# EAGLE design TSOC_ESP32S (EAGLE 6.6.0)
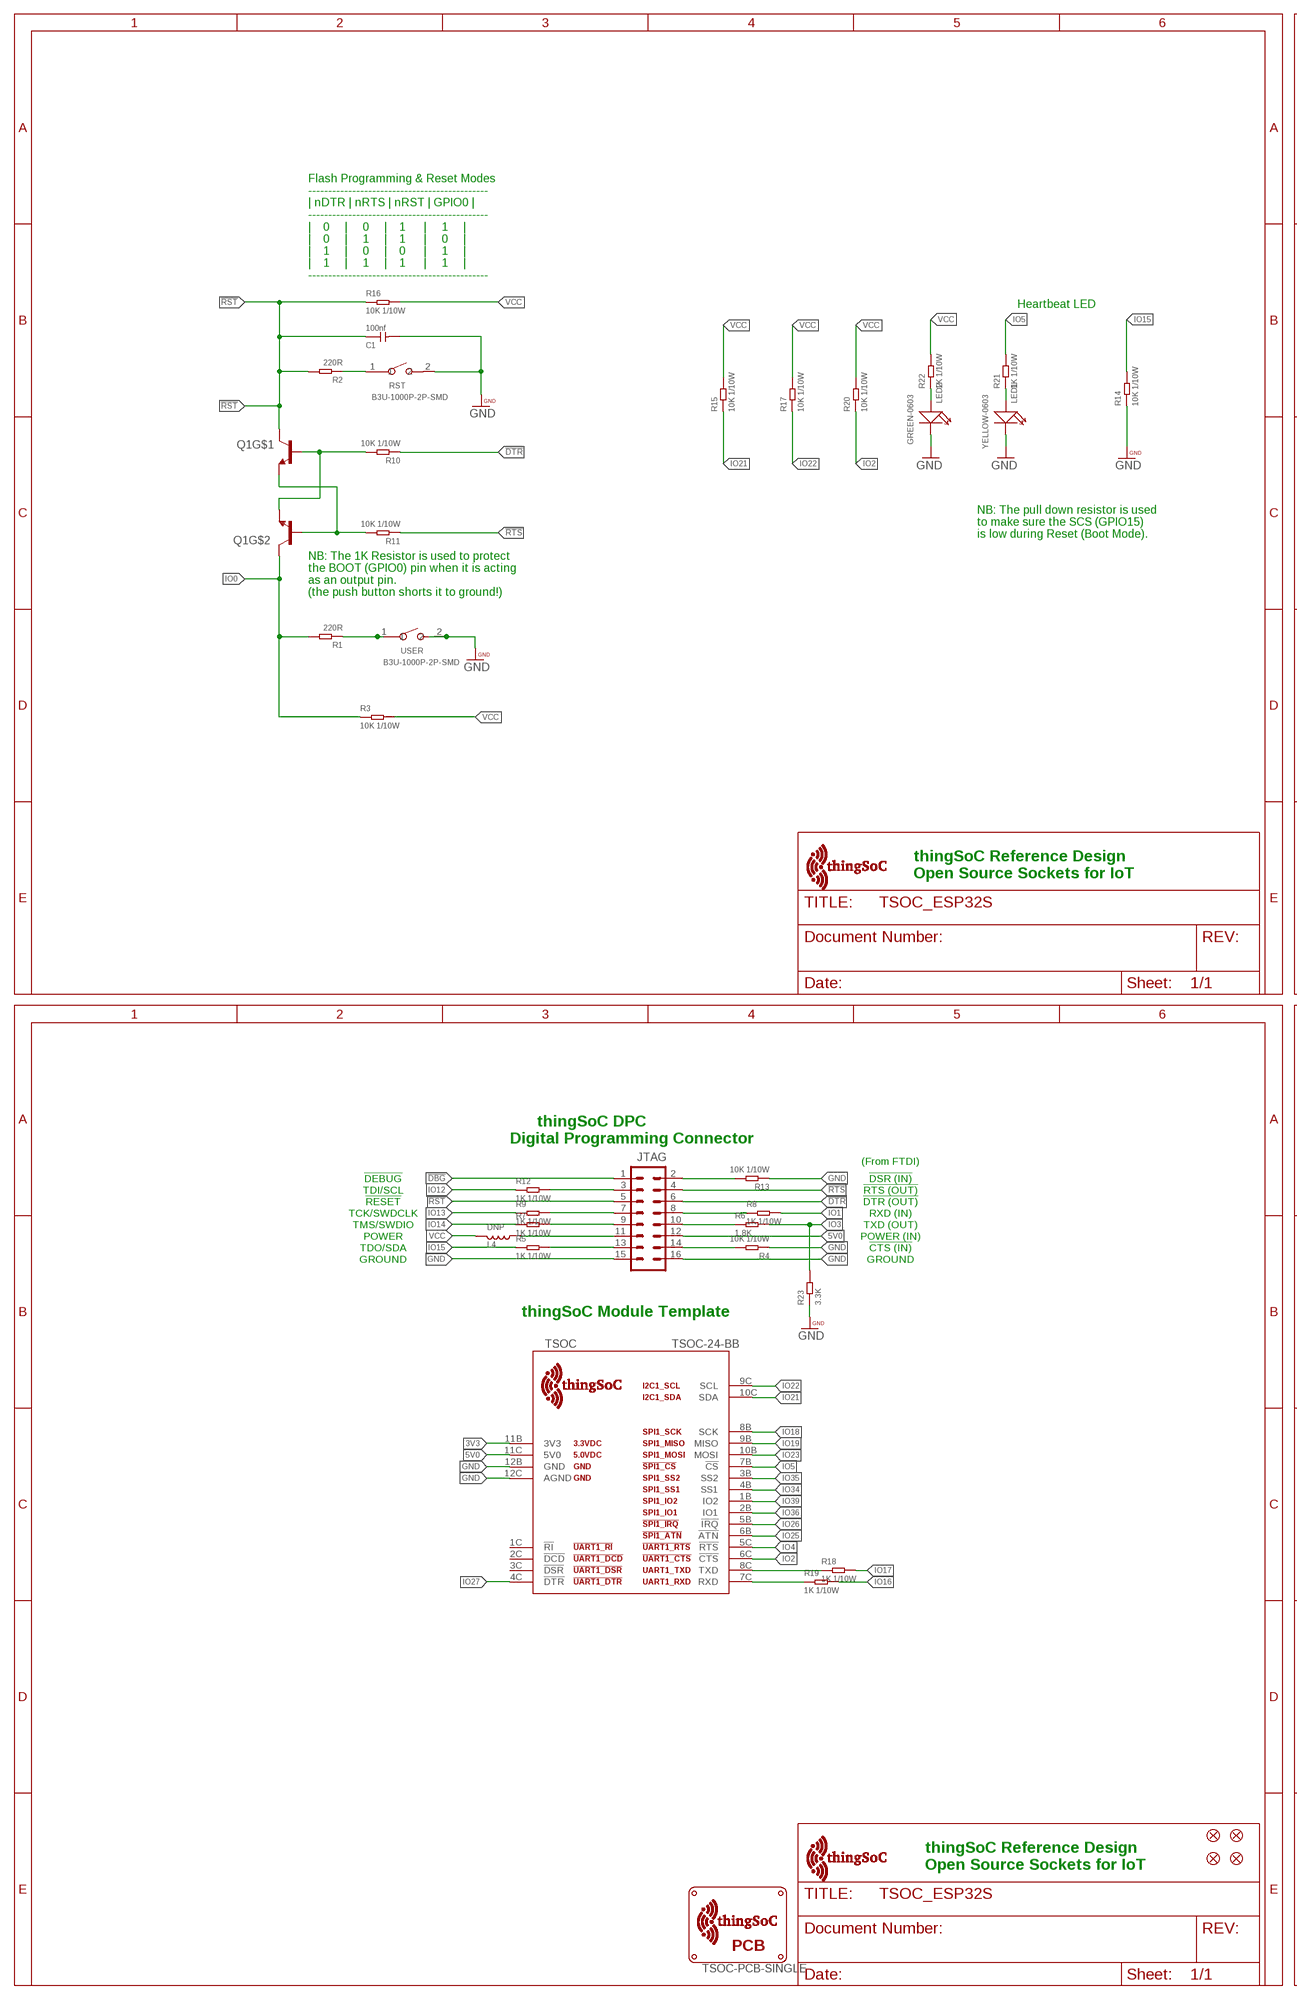
[diagram p0: schematic, sheet 1, part 1 of 2]
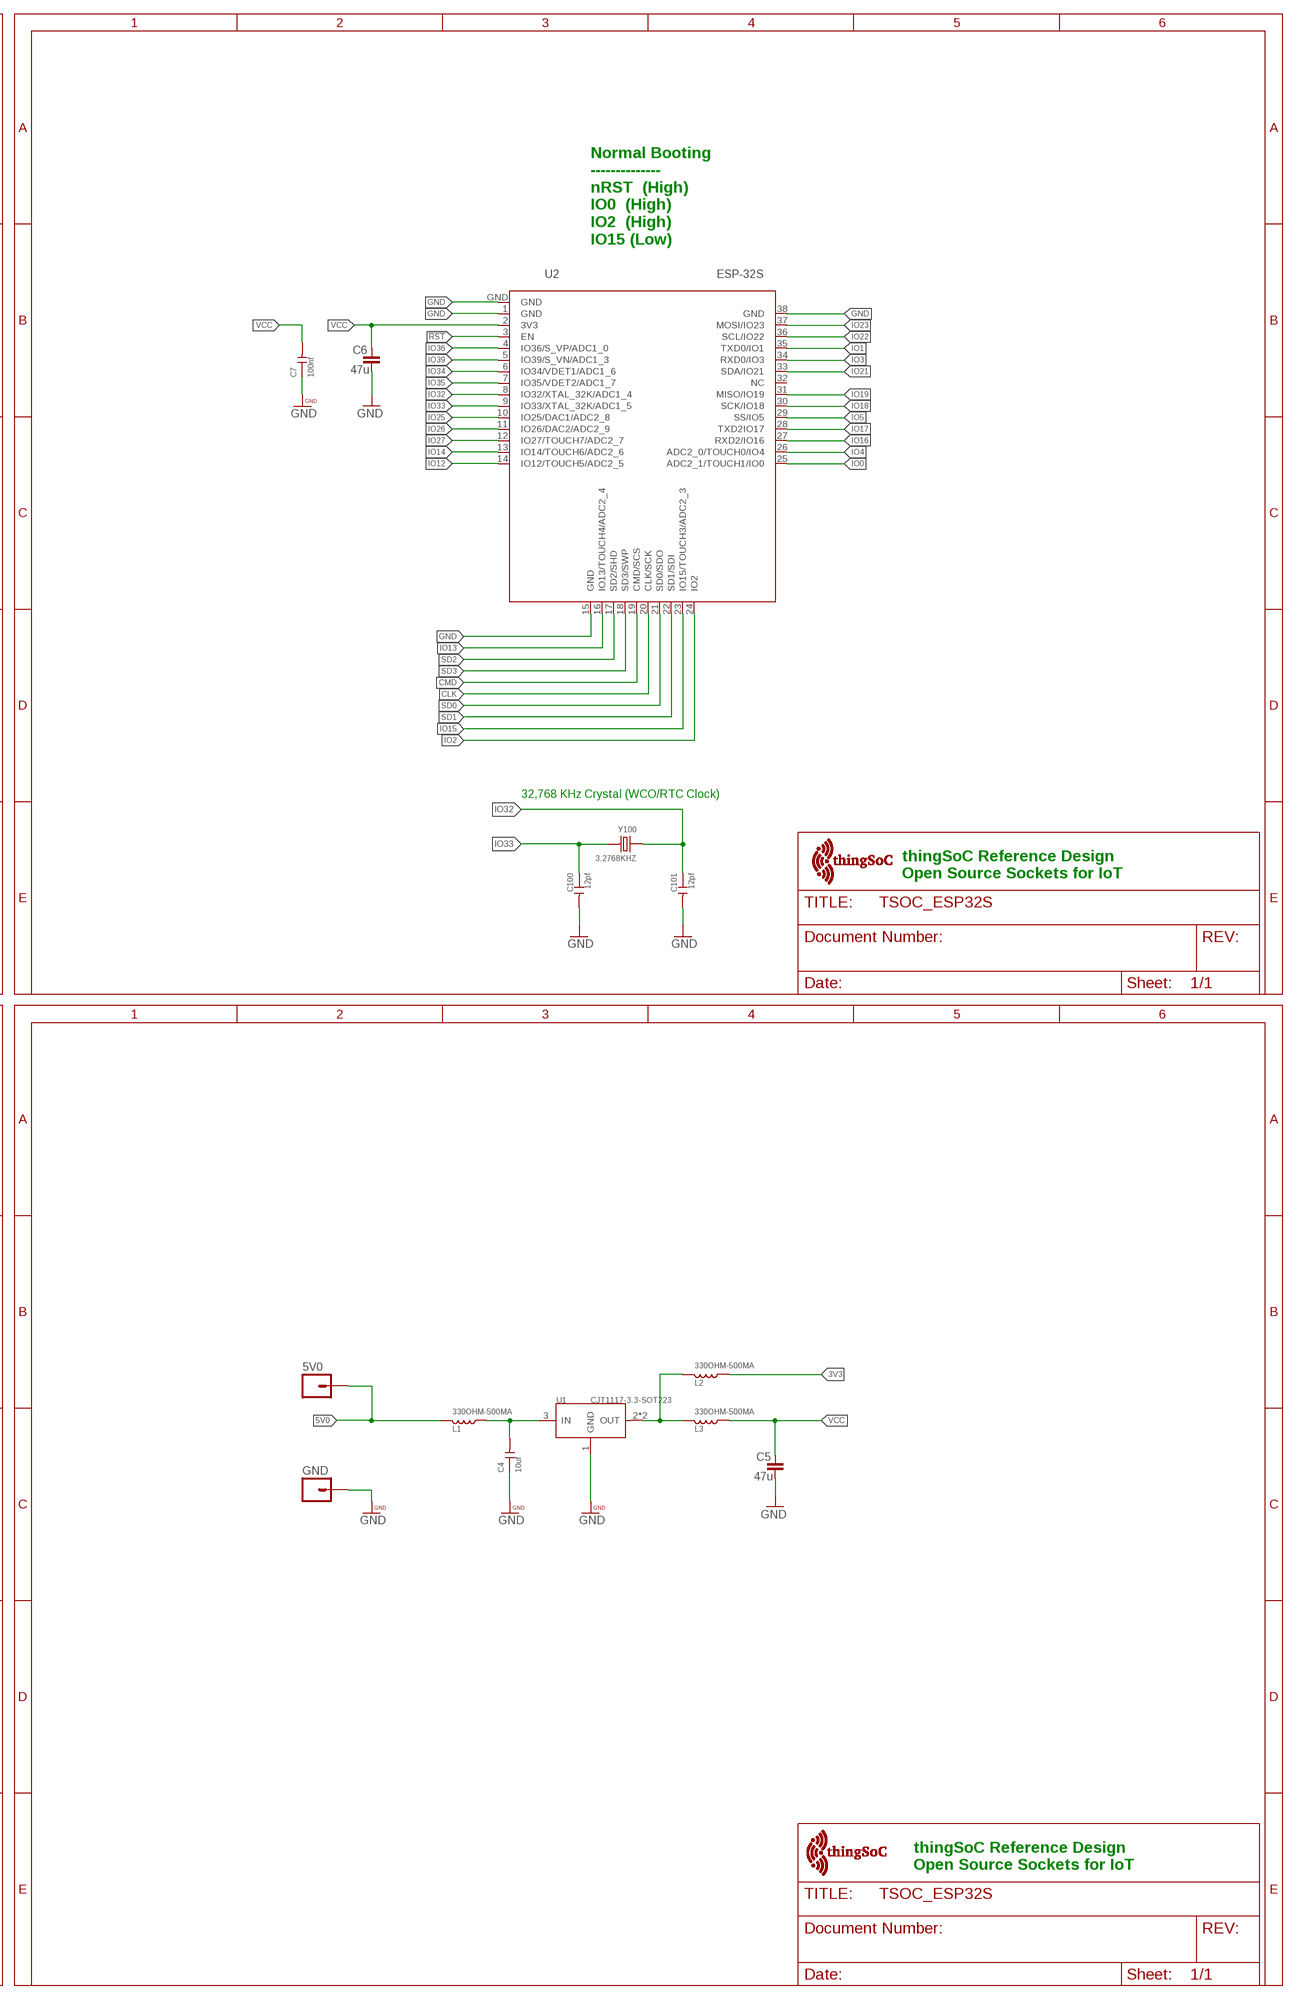
[diagram p1: schematic, sheet 1, part 2 of 2]

## Parts
5V0  M01PTH  [1X01]
$$U$1  TSOC-LOGO-SMALL  [TSOC-LOGO-SML]
$$U$2  TSOC-LOGO-SMALL  [TSOC-LOGO-SML]
BRD  TSOC-PCB-SINGLE  [TSOC-BB-BRD-DIM]
C1  100nf  CERAMIC-100NF-50V-10%-X7R(0603)  [C0603]
C4  10uf  CERAMIC-10UF-10V-10%-X5R(0603)  [C0603]
C5  47u  CAPACITOR-1206  [C1206]
C6  47u  CAPACITOR-1206  [C1206]
C7  100nf  CERAMIC-10UF-10V-10%-X5R(0603)  [C0603]
C100  12pf  CERAMIC-12PF-50V-5%-NPO(0603)  [C0603]
C101  12pf  CERAMIC-12PF-50V-5%-NPO(0603)  [C0603]
FID1  FIDUCIALUFIDUCIAL  [MICRO-FIDUCIAL]
FID2  FIDUCIALUFIDUCIAL  [MICRO-FIDUCIAL]
FID3  FIDUCIALUFIDUCIAL  [MICRO-FIDUCIAL]
FID4  FIDUCIALUFIDUCIAL  [MICRO-FIDUCIAL]
GND  M01PTH  [1X01]
JTAG  M08X2  [2X8]
L1  330OHM-500MA  SMD-FERRITE-CHIP-120-OHM-500MA(0603)  [L0603]
L2  330OHM-500MA  SMD-FERRITE-CHIP-120-OHM-500MA(0603)  [L0603]
L3  330OHM-500MA  SMD-FERRITE-CHIP-120-OHM-500MA(0603)  [L0603]
L4  DNP  SMD-FERRITE-CHIP-120-OHM-500MA(0603)  [L0603]
LED1  YELLOW-0603  SMD-LED-CLEAR-YELLOW(0603)  [LED-0603]
LED2  GREEN-0603  SMD-LED-CLEAR-GREEN(0603)  [LED-0603]
Q1  MMBT2222A  MMDT3904  [SOT363]
R1  220R  SMD-RES-220R-5%-1/10W(0603)  [R0603]
R2  220R  SMD-RES-220R-5%-1/10W(0603)  [R0603]
R3  10K 1/10W  SMD-RES-10K-5%-1/10W(0603)  [R0603]
R4  10K 1/10W  SMD-RES-10K-5%-1/10W(0603)  [R0603]
R5  1K 1/10W  SMD-RES-1K-5%-1/10W(0603)  [R0603]
R6  1.8K  SMD-RES-1.8K-1%-1/10W(0603)  [R0603]
R7  1K 1/10W  SMD-RES-1K-5%-1/10W(0603)  [R0603]
R8  1K 1/10W  SMD-RES-1K-5%-1/10W(0603)  [R0603]
R9  1K 1/10W  SMD-RES-1K-5%-1/10W(0603)  [R0603]
R10  10K 1/10W  SMD-RES-10K-5%-1/10W(0603)  [R0603]
R11  10K 1/10W  SMD-RES-10K-5%-1/10W(0603)  [R0603]
R12  1K 1/10W  SMD-RES-1K-5%-1/10W(0603)  [R0603]
R13  10K 1/10W  SMD-RES-10K-5%-1/10W(0603)  [R0603]
R14  10K 1/10W  SMD-RES-10K-5%-1/10W(0603)  [R0603]
R15  10K 1/10W  SMD-RES-10K-5%-1/10W(0603)  [R0603]
R16  10K 1/10W  SMD-RES-10K-5%-1/10W(0603)  [R0603]
R17  10K 1/10W  SMD-RES-10K-5%-1/10W(0603)  [R0603]
R18  1K 1/10W  SMD-RES-1K-5%-1/10W(0603)  [R0603]
R19  1K 1/10W  SMD-RES-1K-5%-1/10W(0603)  [R0603]
R20  10K 1/10W  SMD-RES-10K-5%-1/10W(0603)  [R0603]
R21  1K 1/10W  SMD-RES-1K-5%-1/10W(0603)  [R0603]
R22  1K 1/10W  SMD-RES-1K-5%-1/10W(0603)  [R0603]
R23  3.3K  SMD-RES-3.3K-1%-1/10W(0603)  [R0603]
RST  B3U-1000P-2P-SMD  SMD-BUTTON(2P-3.0X2.5X1.2+0.4MM)-B3U-1000P-2P-SMD  [SW2-2.6-3.0X2.5X1.2+0.4MM]
TSOC  TSOC-24-BB  [TSOC-BB-S24]
U1  CJT1117-3.3-SOT223  PMIC-CJT1117-3.3(SOT223)  [SOT-223]
U2  ESP-32S  [ESP-32S]
U$101  TSOC-LOGO-SMALL  [TSOC-LOGO-SML]
U$102  TSOC-LOGO-LRG  [TSOC-LOGO-LRG]
USER  B3U-1000P-2P-SMD  SMD-BUTTON(2P-3.0X2.5X1.2+0.4MM)-B3U-1000P-2P-SMD  [SW2-2.6-3.0X2.5X1.2+0.4MM]
Y100  3.2768KHZ  SMD-CRYSTAL-32.768KHZ-12.5PF-20PPM-90K(2P-L2.0X1.2MM)  [X2-SMD-L2.0X1.2X0.55MM]

## Nets
3V3: L2.2 TSOC.11B(3V3)
5V: C4.2 L1.2 U1.3(IN)
5V0: 5V0.1 JTAG.12 L1.1 TSOC.11C(5V0)
!CTS: JTAG.14 R4.2
!DBG: JTAG.1
!DSRE: JTAG.2 R13.2
!DTR: JTAG.6 R10.1
!RST: C1.1 JTAG.5 Q1.3(C) R2.2 R16.1 U2.3(EN)
!RTS: JTAG.4 R11.1
CLK: U2.20(CLK/SCK)
CMD: U2.19(CMD/SCS)
GND: C1.2 C4.1 C5.1 C6.1 C7.1 C100.2 C101.2 GND.1 JTAG.15 JTAG.16 LED1.- LED2.- R4.1 R13.1 R14.1 R23.1 RST.2 TSOC.12B(GND) TSOC.12C(AGND) U1.1(GND) U2.1(GND) U2.15(GND) U2.38(GND) U2.GND USER.2
IO0: Q1.6(C) R1.2 R3.1 U2.25(ADC2_1/TOUCH1/IO0)
IO1: R8.2 U2.35(TXD0/IO1)
IO2: R20.1 TSOC.6C(!CTS) U2.24(IO2)
IO3: R6.2 R23.2 U2.34(RXD0/IO3)
IO4: TSOC.5C(!RTS) U2.26(ADC2_0/TOUCH0/IO4)
IO5: R21.2 TSOC.7B(!CS) U2.29(SS/IO5)
IO12: R12.1 U2.14(IO12/TOUCH5/ADC2_5)
IO12E: JTAG.3 R12.2
IO13: R9.1 U2.16(IO13/TOUCH4/ADC2_4)
IO13E: JTAG.7 R9.2
IO14: R7.1 U2.13(IO14/TOUCH6/ADC2_6)
IO14E: JTAG.9 R7.2
IO15: R5.1 R14.2 U2.23(IO15/TOUCH3/ADC2_3)
IO15E: JTAG.13 R5.2
IO16: R19.2 U2.27(RXD2/IO16)
IO16E: R19.1 TSOC.7C(RXD)
IO17: R18.2 U2.28(TXD2IO17)
IO17E: R18.1 TSOC.8C(TXD)
IO18: TSOC.8B(SCK) U2.30(SCK/IO18)
IO19: TSOC.9B(MISO) U2.31(MISO/IO19)
IO21: R15.1 TSOC.10C(SDA) U2.33(SDA/IO21)
IO22: R17.1 TSOC.9C(SCL) U2.36(SCL/IO22)
IO23: TSOC.10B(MOSI) U2.37(MOSI/IO23)
IO25: TSOC.6B(!ATN) U2.10(IO25/DAC1/ADC2_8)
IO26: TSOC.5B(!IRQ) U2.11(IO26/DAC2/ADC2_9)
IO27: TSOC.4C(!DTR) U2.12(IO27/TOUCH7/ADC2_7)
IO32: C101.1 U2.8(IO32/XTAL_32K/ADC1_4) Y100.1
IO33: C100.1 U2.9(IO33/XTAL_32K/ADC1_5) Y100.2
IO34: TSOC.4B(SS1) U2.6(IO34/VDET1/ADC1_6)
IO35: TSOC.3B(SS2) U2.7(IO35/VDET2/ADC1_7)
IO36: TSOC.2B(IO1) U2.4(IO36/S_VP/ADC1_0)
IO39: TSOC.1B(IO2) U2.5(IO39/S_VN/ADC1_3)
N$1: LED1.+ R21.1
N$2: R1.1 USER.1
N$3: R2.1 RST.1
N$4: JTAG.11 L4.2
N$17: LED2.+ R22.1
RES: Q1.1(E) Q1.5(B) R10.2
ROS: Q1.2(B) Q1.4(E) R11.2
RXI: JTAG.8 R8.1
SD0: U2.21(SD0/SDO)
SD1: U2.22(SD1/SDI)
SD2: U2.17(SD2/SHD)
SD3: U2.18(SD3/SWP)
TXD: JTAG.10 R6.1
VCC: C5.2 C6.2 C7.2 L3.2 L4.1 R3.2 R15.2 R16.2 R17.2 R20.2 R22.2 U2.2(3V3)
VOUT: L2.1 L3.1 U1.2(OUT) U1.TER(OUT)
Unconnected: TSOC.1C(!RI) TSOC.2C(!DCD) TSOC.3C(!DSR) U2.32(NC)

## Notes on the sheet
- Normal Booting
  --------------
  nRST  (High)
  IO0  (High)
  IO2  (High) 
  IO15 (Low)
- Flash Programming & Reset Modes
  ---------------------------------------------
  | nDTR | nRTS | nRST | GPIO0 |
  ---------------------------------------------
  |    0     |     0     |    1      |     1     |
  |    0     |     1     |    1      |     0     |
  |    1     |     0     |    0      |     1     |
  |    1     |     1     |    1      |     1     |
  ---------------------------------------------
- Heartbeat LED
- NB: The pull down resistor is used 
  to make sure the SCS (GPIO15)
  is low during Reset (Boot Mode).
- NB: The 1K Resistor is used to protect
  the BOOT (GPIO0) pin when it is acting
  as an output pin.
  (the push button shorts it to ground!)
- 32,768 KHz Crystal (WCO/RTC Clock)
- thingSoC Reference Design
  Open Source Sockets for IoT
- thingSoC Reference Design
  Open Source Sockets for IoT
- thingSoC DPC
  Digital Programming Connector
- (From FTDI)
- !DEBUG | !DSR (IN)
- TDI/SCL | !RTS (OUT)
- !RESET | !DTR (OUT)
- TCK/SWDCLK | RXD (IN)
- TMS/SWDIO | TXD (OUT)
- POWER | POWER (IN)
- TDO/SDA | !CTS (IN)
- GROUND | GROUND
- thingSoC Module Template
- thingSoC Reference Design
  Open Source Sockets for IoT
- thingSoC Reference Design
  Open Source Sockets for IoT

## Library data of the parts
5V0 GND = PatternAgents-ProtoPads:M01: Header 1 Standard 1-pin 0.1" header. Use with straight break away headers (SKU : PRT-00116), right angle break away headers (PRT-00553), swiss pins (PRT-00743), machine pins (PRT-00117), and female headers (PRT-00115). SMTSO-256-ET is a "flush mount" nut for a 4-40 screw. The older package used to be too tight, and did not allow it to sit properly thru the drill hit. The latest (0.165DIA) fits nice and snug.
$$U$1 $$U$2 U$101 U$102 = thingSoC:TSOC-LOGO: thingSoC Logo Source LBR : http://www.thingsoc.com Github : https://github.com/thingsoc License : http://creativecommons.org/licenses/by-sa/4.0/ (Creative Commons 4.0) THIS SOFTWARE IS PROVIDED BY THE CONTRIBUTORS "AS IS" AND WITHOUT ANY EXPRESS OR IMPLIED WARRANTIES, INCLUDING, BUT NOT LIMITED TO, THE IMPLIED WARRANTIES OF MERCHANTABILITY AND FITNESS FOR A PARTICULAR PURPOSE ARE DISCLAIMED. IN NO EVENT SHALL THE COPYRIGHT OWNER OR CONTRIBUTORS BE LIABLE FOR ANY DIRECT, INDIRECT, INCIDENTAL, SPECIAL, EXEMPLARY, OR CONSEQUENTIAL DAMAGES (INCLUDING, BUT NOT LIMITED TO, PROCUREMENT OF SUBSTITUTE GOODS OR SERVICES; LOSS OF USE, DATA, OR PROFITS; OR BUSINESS INTERRUPTION) HOWEVER CAUSED AND ON ANY THEORY OF LIABILITY, WHETHER IN CONTRACT, STRICT LIABILITY, OR TORT (INCLUDING NEGLIGENCE OR OTHERWISE) ARISING IN ANY WAY OUT OF THE USE OF THIS SOFTWARE, EVEN IF ADVISED OF THE POSSIBILITY OF SUCH DAMAGE.
BRD = thingSoC:TSOC-PCB: thingSoC PCB Outlines Boards Outlines for Standard Sizes (in the DImension Layer) (Registration marks in the tDocu layer - make sure to turn on tDocu/bDocu) Source LBR : http://www.thingsoc.com Github : https://github.com/thingsoc License : http://creativecommons.org/licenses/by-sa/4.0/ (Creative Commons 4.0) THIS SOFTWARE IS PROVIDED BY THE CONTRIBUTORS "AS IS" AND WITHOUT ANY EXPRESS OR IMPLIED WARRANTIES, INCLUDING, BUT NOT LIMITED TO, THE IMPLIED WARRANTIES OF MERCHANTABILITY AND FITNESS FOR A PARTICULAR PURPOSE ARE DISCLAIMED. IN NO EVENT SHALL THE COPYRIGHT OWNER OR CONTRIBUTORS BE LIABLE FOR ANY DIRECT, INDIRECT, INCIDENTAL, SPECIAL, EXEMPLARY, OR CONSEQUENTIAL DAMAGES (INCLUDING, BUT NOT LIMITED TO, PROCUREMENT OF SUBSTITUTE GOODS OR SERVICES; LOSS OF USE, DATA, OR PROFITS; OR BUSINESS INTERRUPTION) HOWEVER CAUSED AND ON ANY THEORY OF LIABILITY, WHETHER IN CONTRACT, STRICT LIABILITY, OR TORT (INCLUDING NEGLIGENCE OR OTHERWISE) ARISING IN ANY WAY OUT OF THE USE OF THIS SOFTWARE, EVEN IF ADVISED OF THE POSSIBILITY OF SUCH DAMAGE.
C1 = Seeed-Capacitor-2016:CERAMIC-100NF-50V-10%-X7R(0603): 302010138; MPN: CC0603KRX7R9BB104
C4 = Seeed-Capacitor-2016:CERAMIC-10UF-10V-10%-X5R(0603): 302010103; MPN: CC0603KRX5R6BB106
C5 C6 = we-rcl:CAPACITOR: Capacitors ...2.2uF @ 6.3V -> 0402 ...4.7uF @ 6.3V -> 0603 ...10uF @ 16V -> 0805 ...22uF @ 25V -> 1206
C7 = Seeed-Capacitor-2016:CERAMIC-10UF-10V-10%-X5R(0603): 302010103; MPN: CC0603KRX5R6BB106; VALUE: 10uf
C100 C101 = Seeed-Capacitor-2016:CERAMIC-12PF-50V-5%-NPO(0603): 302010067; MPN: CC0603JRNPO9BN120
FID1-FID4 = TSOC-ESP8266-BASE:FIDUCIAL: Fiducial Alignment Points Various fiducial points for machine vision alignment.
JTAG = PatternAgents-ProtoPads:M08X2: .1" headers, two rows of 8 each
L1-L4 = Seeed-Inductor-2016:SMD-FERRITE-CHIP-120-OHM-500MA(0603): 303030001; MPN: BLM18AG121SN1D; VALUE: 120OHM-500MA
LED1 = Seeed-LED-2016:SMD-LED-CLEAR-YELLOW(0603): 304090044; MPN: 19-217-Y5C-AM1N1VY-3T
LED2 = Seeed-LED-2016:SMD-LED-CLEAR-GREEN(0603): 304090043; MPN: 19-217-G7C-AN1P2-3T
Q1 = SparkFun-DiscreteSemi:MMDT3904: Dual NPN transistor
R1 R2 = Seeed-Resistor-2016:SMD-RES-220R-5%-1/10W(0603): 301010163; MPN: RC0603JR-07220RL
R3 R4 R10 R11 R13-R17 R20 = Seeed-Resistor-2016:SMD-RES-10K-5%-1/10W(0603): 301010293; MPN: RC0603JR-0710KL
R5 R7-R9 R12 R18 R19 R21 R22 = Seeed-Resistor-2016:SMD-RES-1K-5%-1/10W(0603): 301010291; MPN: RC0603JR-071KL
R6 = Seeed-Resistor-2016:SMD-RES-1.8K-1%-1/10W(0603): 301010254; MPN: RC0603FR-071K8L
R23 = Seeed-Resistor-2016:SMD-RES-3.3K-1%-1/10W(0603): 301010251; MPN: RC0603FR-073K3L
RST USER = Seeed-Switch-2016:SMD-BUTTON(2P-3.0X2.5X1.2+0.4MM): 311020047; MPN: B3U-1000P-2P-SMD
TSOC = thingSoC:TSOC-24: thingSoC Twenty-Four(24) Pin Socket Source LBR : http://www.thingsoc.com Github : https://github.com/thingsoc License : http://creativecommons.org/licenses/by-sa/4.0/ (Creative Commons 4.0) THIS SOFTWARE IS PROVIDED BY THE CONTRIBUTORS "AS IS" AND WITHOUT ANY EXPRESS OR IMPLIED WARRANTIES, INCLUDING, BUT NOT LIMITED TO, THE IMPLIED WARRANTIES OF MERCHANTABILITY AND FITNESS FOR A PARTICULAR PURPOSE ARE DISCLAIMED. IN NO EVENT SHALL THE COPYRIGHT OWNER OR CONTRIBUTORS BE LIABLE FOR ANY DIRECT, INDIRECT, INCIDENTAL, SPECIAL, EXEMPLARY, OR CONSEQUENTIAL DAMAGES (INCLUDING, BUT NOT LIMITED TO, PROCUREMENT OF SUBSTITUTE GOODS OR SERVICES; LOSS OF USE, DATA, OR PROFITS; OR BUSINESS INTERRUPTION) HOWEVER CAUSED AND ON ANY THEORY OF LIABILITY, WHETHER IN CONTRACT, STRICT LIABILITY, OR TORT (INCLUDING NEGLIGENCE OR OTHERWISE) ARISING IN ANY WAY OUT OF THE USE OF THIS SOFTWARE, EVEN IF ADVISED OF THE POSSIBILITY OF SUCH DAMAGE.
U1 = Seeed-IC-2016:PMIC-CJT1117-3.3(SOT223): 310030097; MPN: CJT1117-3.3
U2 = PatternAgents_RFmodules:ESP-32S
Y100 = Seeed-Crystal Oscillator-2016:SMD-CRYSTAL-32.768KHZ-12.5PF-20PPM-90K(2P-L2.0X1.2MM): 306010020; MPN: FC-12M

## Net classes
1 vcc: width 0.254 mm

## Board
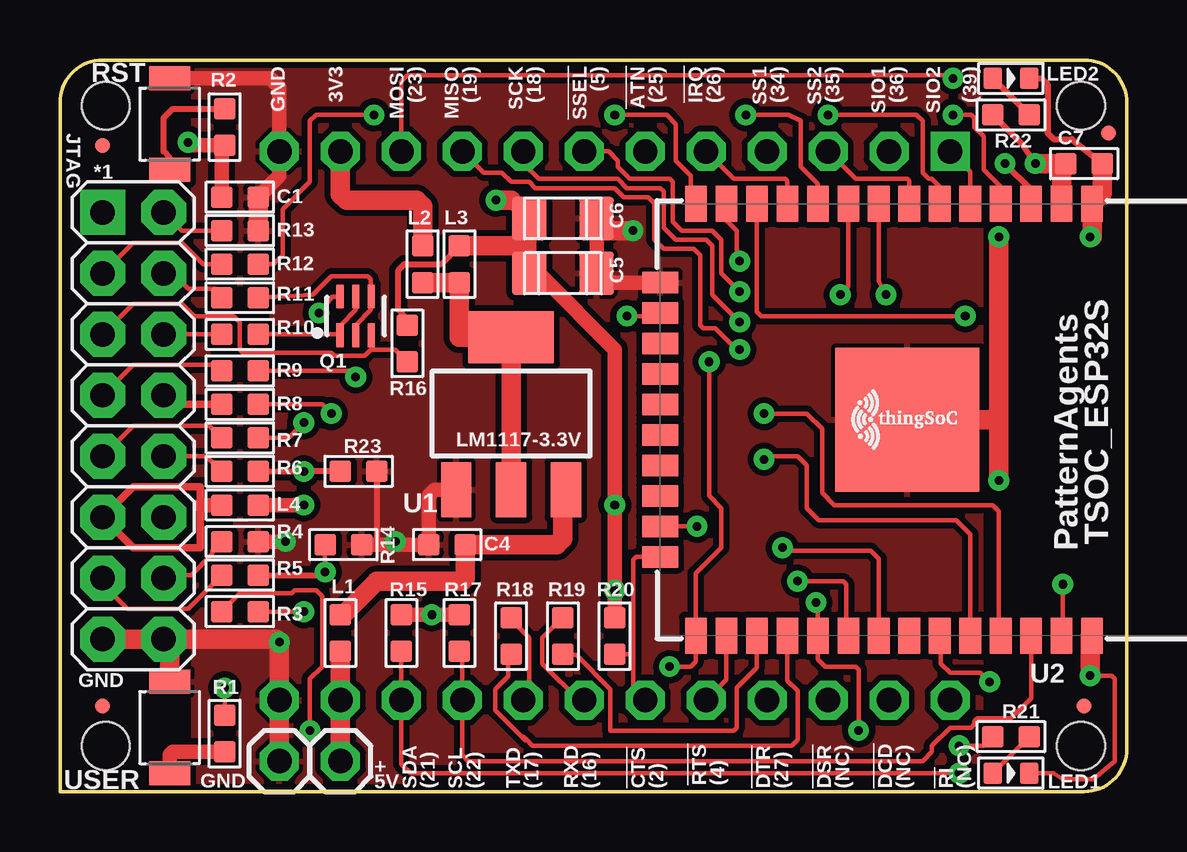
[diagram p2: board, top side]
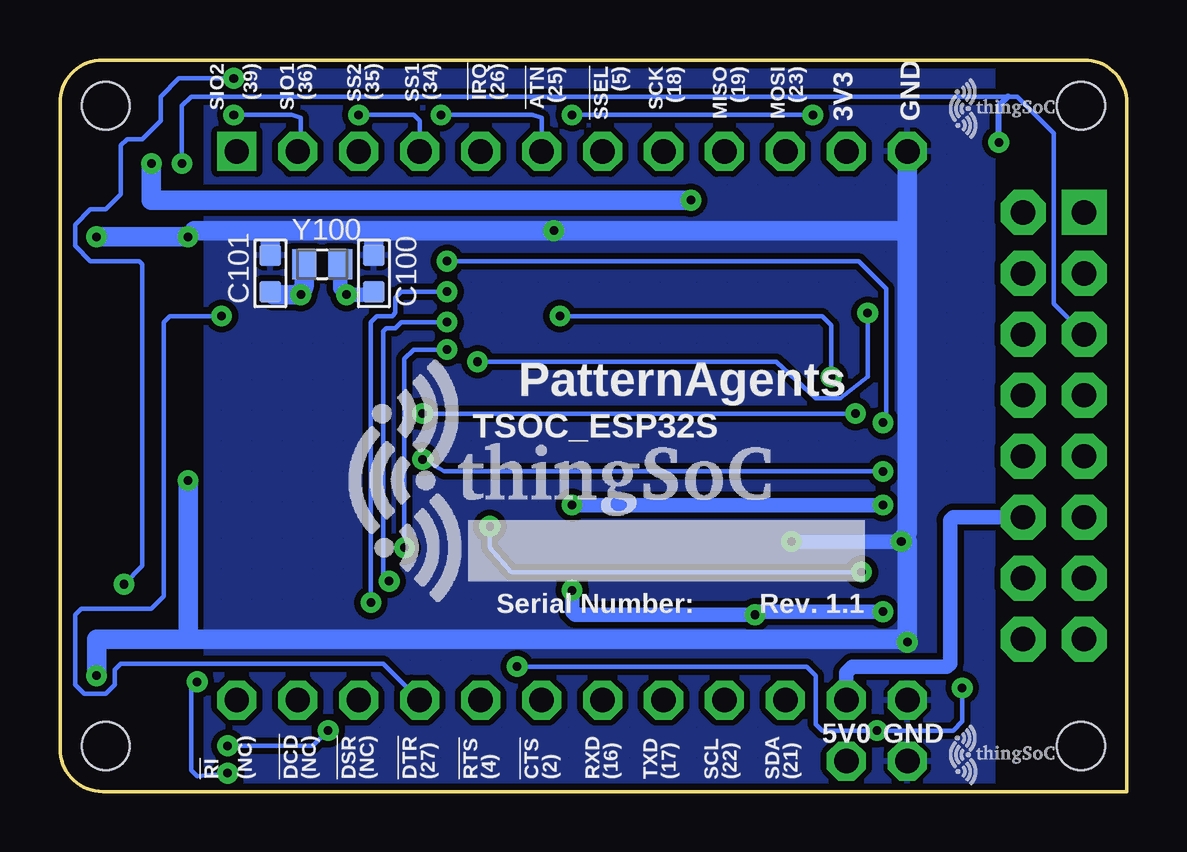
[diagram p3: board, bottom side, seen from below]

Size 44.45 x 30.48 mm. Coordinates in mm from the lower left corner, seen from the top.
Copper layers (1*16): Top 0.035mm / dielectric 1.5mm / Bottom 0.035mm
Design rules "PatternAgents_7mil": minimum track width 7mil, minimum drill 14mil, track to track 7mil, track to pad 7mil, pad to pad 7mil, via to via 7mil, smd to smd 7mil, copper to edge 7mil, drill to drill 7mil, minimum pad ring 12mil, minimum via ring 10mil, stop-mask expansion 4mil, vias tented up to drill 25mil, thermal gap 7mil

### Footprints (pad centres in the part's own frame; a part is rotated, then mirrored left to right if it is on the bottom)
1X01 = drill 1.016 octagon: 1 0,0
TSOC-BB-BRD-DIM = hole 2: 13.335,16.891; -13.335,16.891; 13.335,-23.749; -13.335,-23.749
C0603 = smd 0.889 x 0.889: 1 0,0.762; 2 0,-0.762
C1206 = smd 1.8 x 1.45: 1 0,1.4; 2 0,-1.4
MICRO-FIDUCIAL = smd 0.635 x 0.635: 1 0,0
2X8 = drill 1.016 pad 1.88 square: 1 0,0 | drill 1.016 pad 1.88 octagon: 2 0,2.54; 3 2.54,0; 4 2.54,2.54; 5 5.08,0; 6 5.08,2.54; 7 7.62,0; 8 7.62,2.54; 9 10.16,0; 10 10.16,2.54; 11 12.7,0; 12 12.7,2.54; 13 15.24,0; 14 15.24,2.54; 15 17.78,0; 16 17.78,2.54
L0603 = smd 0.889 x 0.889: 1 -0.762,0; 2 0.762,0
LED-0603 = smd 0.762 x 0.889: + -0.762,0; - 0.762,0
SOT363 = smd 0.3 x 0.99: 1 -0.65,-0.8; 2 0,-0.8; 3 0.65,-0.8; 4 0.65,0.81; 5 0,0.81; 6 -0.65,0.81
R0603 = smd 0.889 x 0.889: 1 0,0.762; 2 0,-0.762
SW2-2.6-3.0X2.5X1.2+0.4MM = smd 1 x 1.7: 1 -1.9,0; 2 1.9,0
TSOC-BB-S24 = drill 1.016 square: 1B -11.43,11.43 | drill 1.016 octagon: 1C 11.43,11.43; 2B -11.43,8.89; 2C 11.43,8.89; 3B -11.43,6.35; 3C 11.43,6.35; 4B -11.43,3.81; 4C 11.43,3.81; 5B -11.43,1.27; 5C 11.43,1.27; 6B -11.43,-1.27; 6C 11.43,-1.27; 7B -11.43,-3.81; 7C 11.43,-3.81; 8B -11.43,-6.35; 8C 11.43,-6.35; 9B -11.43,-8.89; 9C 11.43,-8.89; 10B -11.43,-11.43; 10C 11.43,-11.43; 11B -11.43,-13.97; 11C 11.43,-13.97; 12B -11.43,-16.51; 12C 11.43,-16.51
SOT-223 = smd 1.27 x 2.286: 1 -2.286,-3.175; 2 0,-3.175; 3 2.286,-3.175 | smd 3.556 x 2.159: TER 0,3.175
ESP-32S = smd 0.9 x 1.5: 1 7.7,9; 2 6.43,9; 3 5.16,9; 4 3.89,9; 5 2.62,9; 6 1.35,9; 7 0.08,9; 8 -1.19,9; 9 -2.46,9; 10 -3.73,9; 11 -5,9; 12 -6.27,9; 13 -7.54,9; 14 -8.81,9; 25 -8.81,-9; 26 -7.54,-9; 27 -6.27,-9; 28 -5,-9; 29 -3.73,-9; 30 -2.46,-9; 31 -1.19,-9; 32 0.08,-9; 33 1.35,-9; 34 2.62,-9; 35 3.89,-9; 36 5.16,-9; 37 6.43,-9; 38 7.7,-9 | smd 1.5 x 0.9: 15 -10.3,5.715; 16 -10.3,4.445; 17 -10.3,3.175; 18 -10.3,1.905; 19 -10.3,0.635; 20 -10.3,-0.635; 21 -10.3,-1.905; 22 -10.3,-3.175; 23 -10.3,-4.445; 24 -10.3,-5.715 | smd 6 x 6: GND 0,0
X2-SMD-L2.0X1.2X0.55MM = smd 1 x 1.25: 1 -0.75,0; 2 0.75,0

### Placement (x,y rotation side)
5V0  11.68,1.27 0 top
$$U$1  33.78,15.49 0 top
$$U$2  33.78,15.49 0 top
BRD  25.65,15.24 270 top
C1  7.49,24.77 90 top
C4  16.13,10.29 90 top
C5  20.95,21.59 270 top
C6  20.95,23.88 270 top
C7  42.67,26.16 270 top
C100  31.37,21.59 180 bottom
C101  35.69,21.59 180 bottom
FID1  1.78,3.56 0 top
FID2  1.78,26.92 0 top
FID3  42.67,3.56 0 top
FID4  43.69,27.43 0 top
GND  9.14,1.27 0 top
JTAG  1.78,24.13 270 top
L1  11.68,6.6 90 top
L2  15.11,21.97 90 top
L3  16.64,21.97 90 top
L4  7.49,11.94 180 top
LED1  39.62,0.76 0 top
LED2  39.62,29.72 0 top
Q1  12.32,19.81 0 top
R1  6.86,2.41 180 top
R2  6.86,27.69 0 top
R3  7.49,7.49 90 top
R4  7.49,10.41 270 top
R5  7.49,9.02 270 top
R6  7.49,13.34 90 top
R7  7.49,14.73 270 top
R8  7.49,16.13 90 top
R9  7.49,17.53 270 top
R10  7.49,19.05 90 top
R11  7.49,20.57 90 top
R12  7.49,21.97 270 top
R13  7.49,23.37 270 top
R14  11.81,10.29 270 top
R15  14.22,6.6 180 top
R16  14.48,18.67 180 top
R17  16.64,6.6 180 top
R18  18.8,6.48 0 top
R19  20.95,6.48 0 top
R20  23.11,6.48 180 top
R21  39.62,2.29 270 top
R22  39.62,28.19 270 top
R23  12.45,13.34 270 top
RST  4.57,27.81 90 top
TSOC  25.65,15.24 270 top
U1  18.8,15.75 0 top
U2  35.31,15.49 0 top
U$100  TSOC-LOGO-SMALL  [TSOC-LOGO-SML]  6.6,1.52 0 bottom
U$101  6.6,28.45 0 bottom
U$102  29.21,12.95 0 bottom
USER  4.57,2.67 90 top
Y100  33.53,21.97 0 bottom

### Tracks (layer width: path | path; a pad name or v marks a point on that pad's centre or on a via)
3V3
  Top 0.813: L2.2 15.11,24.38 14.86,24.64 11.94,24.64 11.68,24.89 TSOC.11B
5V
  Top 0.813: L1.2 11.81,7.37 13.21,8.76 16.76,8.76 16.89,8.89 C4.2 20.7,10.29 20.95,10.54 20.95,12.45 U1.3
5V0
  Top 0.813: 5V0.1 TSOC.11C L1.1
  Bottom 0.61: JTAG.12 7.24,11.43 7.37,11.3 7.37,5.33 7.49,5.21 11.43,5.21 11.68,4.95 TSOC.11C
!CTS
  Top 0.178: 4.45,9.02 5.46,9.02 6.35,9.91 6.35,10.03 R4.2 | 4.45,9.02 4.45,8.89 JTAG.14 | 4.45,9.07 4.45,9.02
!DSRE
  Top 0.178: JTAG.2 5.08,23.37 R13.2
!DTR
  Top 0.178: R10.1 JTAG.6
!RST  (via drill 0.36)
  Top 0.178: Q1.3 12.97,18.43 12.95,18.41 | 12.95,18.41 12.7,18.16 11.43,18.16 11.3,18.29 7.62,18.29 7.49,18.41 7.49,19.56 7.24,19.81 5.59,19.81 5.08,20.32 3.05,20.32 JTAG.5 | 12.95,18.41 13.97,18.41 R16.1
  Top 0.254: U2.3 40.47,25.07 v39.37,26.16
  Top 0.61: v5.33,27.05 5.46,26.92 R2.2 6.73,26.8 C1.1
  Bottom 0.178: v39.37,26.16 39.37,28.57 38.99,28.96 4.95,28.96 4.57,28.96 3.05,27.43 3.05,20.32 JTAG.5
  Bottom 0.254: v5.33,27.05 5.33,28.57 4.95,28.96
!RTS
  Top 0.178: JTAG.4 4.7,21.59 5.33,20.95 6.48,20.95 R11.1
GND  (via drill 0.36)
  Top 0.178: LED1.- 41.4,0.76 41.78,0.51 43.05,0.51 43.94,1.27 43.94,4.7 43.81,4.83 v42.93,4.83
  Top 0.254: LED2.- 40.89,29.72 41.15,29.46 41.15,27.43 41.4,27.18 42.16,27.18 C7.1 | R23.1 13.21,10.41 v13.97,10.41
  Top 0.61: RST.2 8.77,29.71 9.14,29.34 TSOC.12B 9.14,25.65 C1.2 | U2.15 22.74,21.21 C5.1 22.36,23.36 22.35,23.37 C6.1 | R4.1 v9.4,10.41 | R14.1 13.84,10.29 v13.97,10.41 14.1,10.29 C4.1 15.37,12.32 15.62,12.57 U1.1
  Top 0.813: v42.93,23.11 43.01,23.11 U2.1 43.43,24.92 C7.1 | U2.15 25.15,21.21 | U2.38 42.93,6.49 v42.93,4.83 | JTAG.15 JTAG.16 | v39.12,23.11 39.12,15.49 | 39.12,15.49 v39.12,12.95 | U2.GND 39.12,15.49 | C6.1 22.36,23.37 v23.88,23.37 | R13.1 C1.2 | USER.2 4.57,6.1 JTAG.16 | JTAG.16 9.02,6.35 v9.14,6.22 TSOC.12C GND.1
  Bottom 0.61: v13.97,10.41 9.14,10.41
  Bottom 0.813: TSOC.12B 9.14,23.37 | 9.14,23.37 v23.88,23.37 31.5,23.37 | 9.14,6.35 39.12,6.35 | 39.12,6.35 42.93,6.35 v42.93,4.83 | v9.14,6.22 9.14,6.35 | 9.14,23.37 9.14,10.79 v9.4,10.41 9.14,10.41 9.14,6.35 | v39.12,12.95 39.12,6.35 | 31.5,23.37 35.56,23.37 | 35.56,23.37 38.86,23.37 v39.12,23.11 v42.93,23.11 | C100.2 31.37,23.24 31.5,23.37 | C101.2 35.69,23.24 35.56,23.37
  pour Top (isolate 0.254, hatched): 5.59,0 5.59,30.48 38.35,30.48 38.35,0
  pour Bottom (isolate 0.254, hatched): 5.59,0 5.59,30.48 38.35,30.48 38.35,0
IO0  (via drill 0.36)
  Top 0.178: U2.25 26.5,5.92 | U2.25 26.5,5.41 26.29,5.21 v25.4,5.21 | Q1.6 11.35,20.62 v10.79,19.94 | U2.25 26.5,9.1 27.56,10.16 27.56,11.81 27.05,12.32 v27.05,17.91 | R1.2 v6.86,4.32 | R3.1 7.49,8.26 9.65,8.26 9.78,8.38 10.67,8.38 10.92,8.13 10.92,5.21 10.41,4.7 v10.41,2.54
  Bottom 0.178: v25.4,5.21 13.34,5.21 12.95,4.83 12.95,2.79 12.7,2.54 v10.41,2.54 7.24,2.54 6.86,2.92 v6.86,4.32 | v27.05,17.91 14.61,17.91 12.95,16.38 11.94,16.38 10.79,17.27 v10.79,19.94
IO1  (via drill 0.36)
  Top 0.178: v29.34,15.75 31.11,15.75 31.75,15.11 31.75,12.45 32.26,11.94 38.86,11.94 39.12,11.68 39.12,6.57 U2.35 | R8.2 10.92,16.13 v11.3,15.75
  Bottom 0.178: v11.3,15.75 v29.34,15.75
IO2
  Top 0.178: U2.24 24,9.78 23.88,9.65 23.88,5.59 | 23.88,5.59 23.88,4.32 TSOC.6C | R20.1 23.75,5.71 23.88,5.59
IO3  (via drill 0.36)
  Top 0.178: U2.34 37.93,10.71 37.34,11.3 31.62,11.3 31.11,11.81 31.11,13.59 30.73,13.97 29.46,13.97 v29.34,13.84
  Top 0.254: R6.2 v10.16,13.34 R23.2
  Bottom 0.178: v10.16,13.34 28.45,13.34 v29.34,13.84
IO4
  Top 0.178: U2.26 27.77,4.65 TSOC.5C
IO5  (via drill 0.36)
  Top 0.178: 31.62,6.45 U2.29 | TSOC.7B 22.86,26.67 23.24,26.29 23.24,26.04 23.75,25.53 25.4,25.53 25.53,25.4 25.53,23.75 25.91,23.37 27.18,23.37 27.56,22.99 27.56,21.59 v28.32,20.83 | U2.29 31.58,7.79 v31.5,7.87 | U2.29 31.58,5.51 31.88,5.21 33.15,5.21 33.27,5.08 v33.27,2.54 | v37.47,1.91 38.48,1.91 R21.2
  Bottom 0.178: v31.5,7.87 31.5,19.56 31.24,19.81 30.61,19.81 30.48,19.94 30.48,20.57 30.23,20.83 v28.32,20.83 | v37.47,1.91 33.91,1.91 v33.27,2.54
IO12  (via drill 0.36)
  Top 0.178: v23.11,28.19 25.27,28.19 25.65,27.81 25.65,26.29 26.29,25.65 26.29,24.7 U2.14 | R12.1 8.89,21.97 9.27,22.35 9.27,24.26 10.41,25.4 10.41,27.94 10.67,28.19 v13.08,28.19
  Bottom 0.178: v13.08,28.19 v23.11,28.19
IO12E
  Top 0.178: JTAG.3 3.05,22.86 5.08,22.86 5.97,21.97 R12.2
IO13  (via drill 0.36)
  Top 0.178: v23.62,19.81 24.88,19.81 U2.16 | R9.1 12.06,17.53 v12.32,17.27
  Bottom 0.178: v12.32,17.27 12.32,19.43 12.7,19.81 v23.62,19.81
IO13E
  Top 0.178: JTAG.7 3.05,17.78 6.48,17.78 R9.2
IO14  (via drill 0.36)
  Top 0.178: U2.13 27.77,23.8 28.19,23.37 28.19,22.23 v28.32,22.1 | R7.1 9.53,14.73 v10.16,15.37
  Bottom 0.178: v28.32,22.1 11.18,22.1 10.03,20.95 10.03,15.49 v10.16,15.37
IO14E
  Top 0.178: JTAG.9 3.05,15.24 6.22,15.24 R7.2
IO15  (via drill 0.36)
  Top 0.178: 10.92,10.16 R14.2 | v26.54,11.05 U2.23 | 11.05,10.41 R14.2 | R14.2 11.02,10.13 11.02,9.25 v11.05,9.14
  Top 0.254: R5.1 10.92,9.02 v11.05,9.14
  Bottom 0.178: v11.05,9.14 25.65,9.14 26.54,10.16 v26.54,11.05
IO15E
  Top 0.178: 1.78,9.02 JTAG.13 1.78,8.64 2.79,7.62 5.33,7.62 R5.2
IO16
  Top 0.178: U2.27 29.04,5.16 28.19,4.32 28.19,2.67 28.07,2.54 22.94,2.54 22.94,4.27 21.51,5.69 20.98,5.69 R19.2
IO16E
  Top 0.178: R19.1 20.8,7.11 20.09,6.4 20.09,5.33 21.69,3.73 TSOC.7C
IO17
  Top 0.178: U2.28 30.31,4.62 30.73,4.19 30.73,2.16 30.48,1.91 19.68,1.91 19.42,2.17 | 19.42,2.17 19.3,2.29 | R18.2 18.67,5.69 18.67,4.8 18.14,4.27 18.14,3.38 19.38,2.13 19.42,2.17
IO17E
  Top 0.178: R18.1 18.85,7.11 19.56,6.4 19.56,4.09 19.38,3.91 TSOC.8C
IO18  (via drill 0.36)
  Top 0.178: TSOC.8B 19.3,26.16 19.94,25.53 23.24,25.53 23.62,25.15 25.02,25.15 25.15,25.02 25.15,23.5 25.65,22.99 26.92,22.99 27.18,22.73 27.18,20.7 v28.32,19.56 | v30.73,8.76 32.64,8.76 32.77,8.64 32.77,6.57 U2.30
  Bottom 0.178: v28.32,19.56 30.23,19.56 30.48,19.3 30.86,19.3 30.99,19.18 30.99,8.89 v30.73,8.76
IO19  (via drill 0.36)
  Top 0.178: TSOC.9B 17.65,25.78 18.41,25.78 18.8,25.4 19.56,25.4 19.81,25.15 23.11,25.15 23.5,24.77 24.51,24.77 24.77,24.51 24.77,22.99 25.15,22.61 26.42,22.61 26.67,22.35 26.67,19.43 26.8,19.3 27.3,19.3 28.19,18.41 v28.32,18.41 | U2.31 34.12,9.7 33.78,10.03 30.23,10.03 v30.1,10.16
  Bottom 0.178: v30.1,10.16 30.1,18.03 29.72,18.41 v28.32,18.41
IO21  (via drill 0.36)
  Top 0.178: v37.47,0.76 14.61,0.76 14.22,1.14 TSOC.10C R15.1 | v38.73,4.57 38.35,4.95 37.08,4.95 36.7,5.33 36.7,6.45 U2.33
  Bottom 0.178: v37.47,0.76 38.73,0.64 38.99,0.89 38.99,4.45 v38.73,4.57
IO22
  Top 0.178: U2.36 40.47,3.89 39.62,3.05 38.23,3.05 38.1,2.92 38.1,2.79 37.97,2.67 37.08,2.67 36.32,1.91 36.32,1.65 35.94,1.27 17.02,1.27 16.76,1.52 TSOC.9C 16.76,5.71 R17.1
IO23  (via drill 0.36)
  Top 0.178: TSOC.10B 14.22,29.59 14.48,29.84 37.08,29.84 v37.21,29.72 | v41.78,8.64 41.78,6.54 U2.37
  Bottom 0.178: v37.21,29.72 39.5,29.72 40.26,28.96 40.26,27.94 41.02,27.18 41.66,27.18 41.91,26.92 41.91,24.89 42.55,24.26 43.18,24.26 43.81,23.62 43.81,22.73 43.18,22.1 41.15,22.1 41.02,21.97 41.02,9.4 v41.78,8.64
IO25  (via drill 0.36)
  Top 0.178: U2.10 31.58,25.32 30.86,26.04 30.86,27.94 30.35,28.19 v28.57,28.19
  Bottom 0.178: v28.57,28.19 24.77,28.19 24.38,28.07 TSOC.6B
IO26
  Top 0.178: U2.11 30.31,25.45 30.23,25.53 28.07,25.53 TSOC.5B
IO27  (via drill 0.36)
  Top 0.178: U2.12 29.04,19.99 29.21,19.81 v37.72,19.81
  Bottom 0.178: v37.72,19.81 39.88,19.81 40.13,19.56 40.13,8.13 40.64,7.62 43.56,7.62 43.81,7.37 43.81,4.45 43.43,4.06 42.55,4.06 42.16,4.45 42.16,5.08 41.91,5.33 30.99,5.33 TSOC.4C
IO32  (via drill 0.36)
  Top 0.178: U2.8 34.12,21.26 v34.42,20.7
  Bottom 0.813: Y100.1 34.28,21.09 v34.42,20.7 35.56,20.7 C101.1
IO33  (via drill 0.36)
  Top 0.178: U2.9 32.85,21.04 v32.51,20.7
  Bottom 0.61: C100.1 31.5,20.7 v32.51,20.7 32.78,20.97 Y100.2
IO34  (via drill 0.36)
  Top 0.178: U2.6 36.66,25.19 36.32,25.53 36.2,25.53 35.94,25.78 35.94,27.94 35.69,28.19 v32,28.19
  Bottom 0.178: v32,28.19 29.72,28.19 29.46,27.94 TSOC.4B
IO35
  Top 0.178: U2.7 35.39,25.45 35.31,25.53 33.15,25.53 TSOC.3B
IO36  (via drill 0.36)
  Top 0.178: U2.4 39.2,25.19 38.48,25.91 38.48,27.3 38.1,27.69 38.1,28.07 37.97,28.19 v37.21,28.19
  Bottom 0.178: v37.21,28.19 34.8,28.19 34.42,28.07 34.42,26.8 TSOC.2B
IO39
  Top 0.178: U2.5 37.93,25.83 TSOC.1B
N$1
  Top 0.178: LED1.+ R21.1
N$2
  Top 0.61: R1.1 4.7,1.65 4.57,1.52 USER.1
N$3
  Top 0.254: RST.1 4.57,26.42 4.32,26.67 4.32,28.07 4.7,28.45 R2.1
N$4
  Top 0.305: JTAG.11 3.05,12.7 5.84,12.7 5.84,11.94 5.84,10.16 3.05,10.16 JTAG.11
  Top 0.61: L4.2 5.84,11.94
N$17
  Top 0.254: R22.1 LED2.+
RES
  Top 0.178: Q1.5 12.32,20.07 11.67,19.42 Q1.1 11.63,19.05 R10.2
ROS
  Top 0.178: Q1.2 12.32,19.43 12.95,20.07 12.95,20.61 Q1.4 12.95,20.64 12.95,21.34 12.83,21.46 11.3,21.46 10.54,20.7 R11.2
RXI
  Top 0.305: R8.1 4.7,16.13 JTAG.8
TXD
  Top 0.178: JTAG.10 6.1,13.97 R6.1
VCC  (via drill 0.36)
  Top 0.178: U2.2 41.74,24.64 | 8,7.49 8.18,7.49 | 8.18,7.49 v10.16,7.49 | R3.2 8.18,7.47 8.18,7.49
  Top 0.254: v40.64,26.16 40.13,26.92 R22.2 | R16.2 14.48,19.68 14.1,20.07 14.1,21.72 14.35,21.97 15.88,21.97 L3.2
  Top 0.61: 14.1,7.49 R15.2 v15.49,7.37 R17.2 | 19.55,22.99 C6.2 18.8,24.64 | 19.55,22.99 C5.2 19.68,21.46 20.07,21.46 23.11,18.41 v23.11,11.94 v23.11,8.38 R20.2 | 19.3,22.73 19.55,22.99 | v10.16,11.94 L4.1
  Top 0.813: v40.64,26.16 C7.2 41.74,26.08 41.74,24.64 | v18.16,24.64 18.8,24.64 | L3.2 19.3,22.73
  Bottom 0.61: v23.11,8.38 23.11,7.49 22.99,7.37 v15.49,7.37 15.37,7.49 v10.16,7.49 | v10.16,11.94 v23.11,11.94
  Bottom 0.813: v18.16,24.64 40.64,24.64 v40.64,26.16
VOUT
  Top 0.813: U1.2 U1.TER 16.64,18.92 L3.1 L2.1

### Text on the board
tPlace: GND | 3V3 | MOSI | (23) | MISO | (19) | SCK | (18) | !SSEL | (5) | !ATN | (25) | !IRQ | (26) | SS1 | (34) | SS2 | (35) | SIO1 | (36) | SIO2 | (39) | *1 | Q1 | LM1117-3.3V | PatternAgents | TSOC_ESP32S | GND | GND | + | 5V | SDA | (21) | SCL | (22) | TXD | (17) | RXD | (16) | !CTS | (2) | !RTS | (4) | !DTR | (27) | !DSR | (NC) | !DCD | (NC) | !RI | (NC)
bPlace: (23) | MOSI | (19) | MISO | (18) | SCK | (5) | !SSEL | (25) | !ATN | (26) | !IRQ | (34) | SS1 | (35) | SS2 | (36) | SIO1 | (39) | SIO2 | GND | 3V3 | PatternAgents | TSOC_ESP32S | Rev. 1.1 | Serial Number: | GND | 5V0 | (21) | SDA | (22) | SCL | (17) | TXD | (16) | RXD | (2) | !CTS | (4) | !RTS | (27) | !DTR | (NC) | !DSR | (NC) | !DCD | (NC) | !RI